# EAGLE design HW2_schematic (EAGLE 9.3.0)
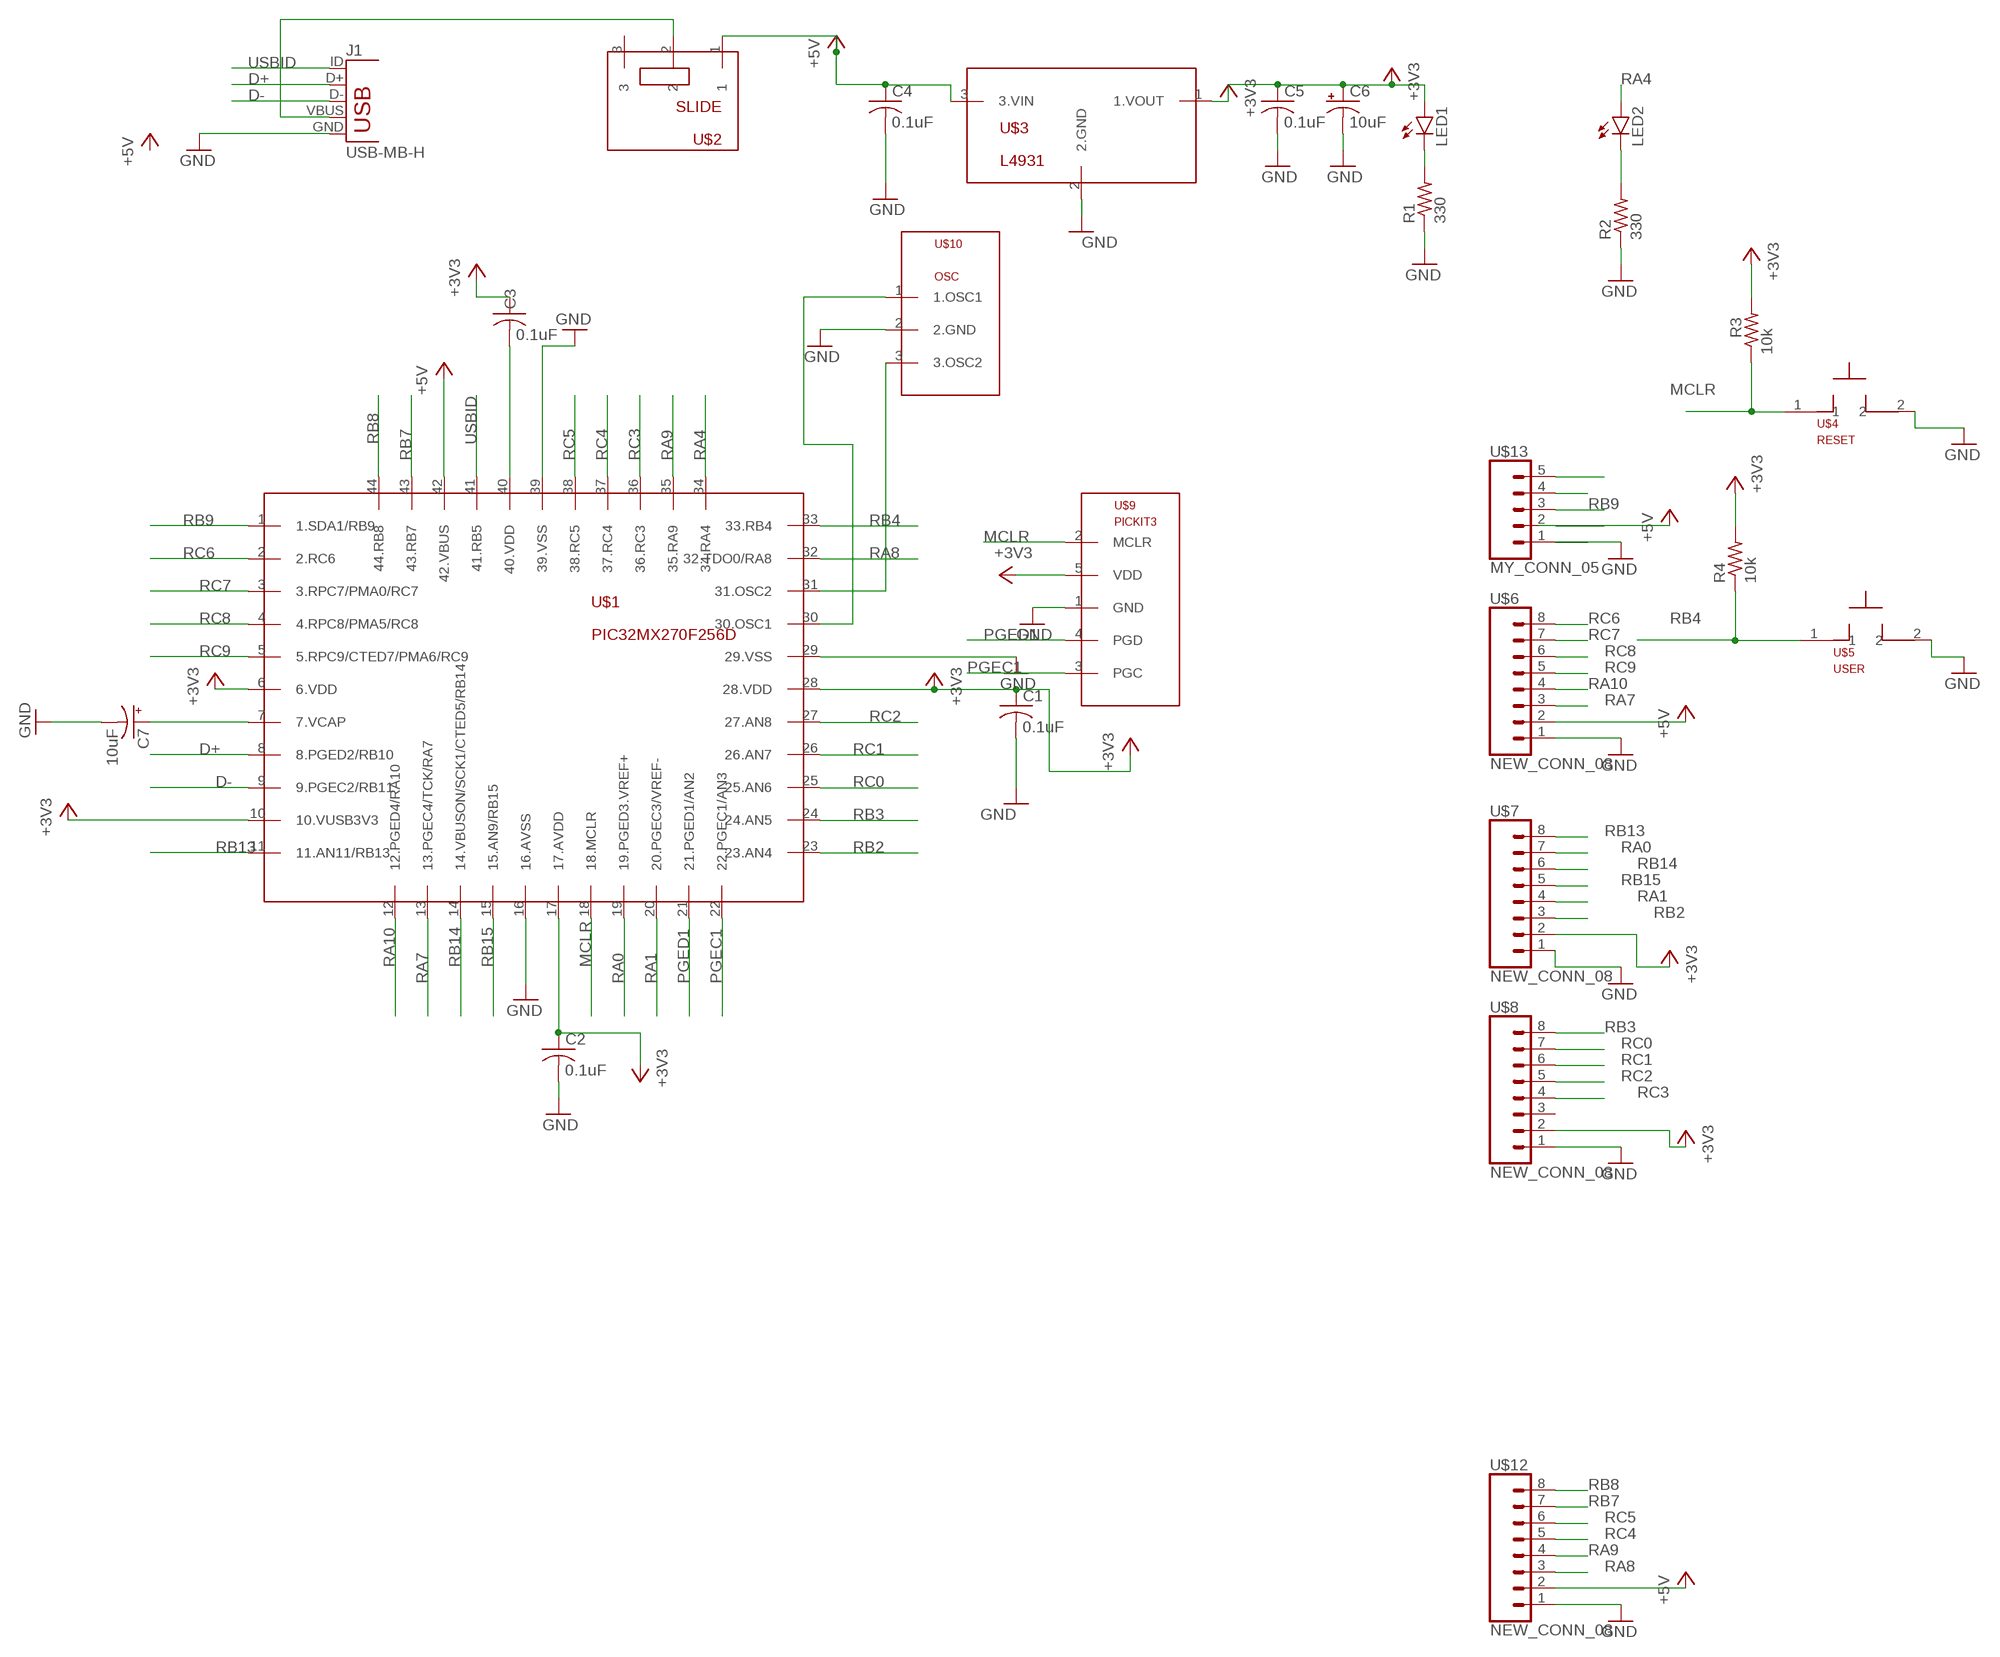
[diagram p0: schematic, sheet 1]

## Parts
C1  0.1uF  C-US025-025X050  [C025-025X050]
C2  0.1uF  C-US025-025X050  [C025-025X050]
C3  0.1uF  C-US025-025X050  [C025-025X050]
C4  0.1uF  C-US025-025X050  [C025-025X050]
C5  0.1uF  C-US025-025X050  [C025-025X050]
C6  10uF  CPOL-USB45181B  [B45181B]
C7  10uF  CPOL-USB45181B  [B45181B]
J1  USB-MB-H  [USB-MB-H]
LED1  LED3MM  [LED3MM]
LED2  LED3MM  [LED3MM]
R1  330  R-US_0207/10  [0207/10]
R2  330  R-US_0207/10  [0207/10]
R3  10k  R-US_0207/10  [0207/10]
R4  10k  R-US_0207/10  [0207/10]
U$1  PIC32MX270F256D  [QFN44ML8X8]
U$2  SLIDE  [SLIDE]
U$3  L4931  [TO92]
U$4  RESET  PB  [PB]
U$5  USER  PB  [PB]
U$6  NEW_CONN_08  [1X08]
U$7  NEW_CONN_08  [1X08]
U$8  NEW_CONN_08  [1X08]
U$9  PICKIT3  [1X05]
U$10  OSC  [OSC]
U$12  NEW_CONN_08  [1X08]
U$13  MY_CONN_05  [1X05]

## Nets
+3V3: C1.1 C2.1 C3.1 C5.1 C6.+ LED1.A R3.2 R4.2 U$1.6(6.VDD) U$1.10(10.VUSB3V3) U$1.17(17.AVDD) U$1.28(28.VDD) U$3.1(1.VOUT) U$7.2 U$8.2 U$9.5(VDD)
+5V: C4.1 U$1.42(42.VBUS) U$2.1 U$3.3(3.VIN) U$6.2 U$12.2
D+: J1.D+ U$1.8(8.PGED2/RB10)
D-: J1.D- U$1.9(9.PGEC2/RB11)
GND: C1.2 C2.2 C4.2 C5.2 C6.- C7.- J1.GND R1.1 R2.1 U$1.16(16.AVSS) U$1.29(29.VSS) U$1.39(39.VSS) U$3.2(2.GND) U$4.2 U$5.2 U$6.1 U$7.1 U$8.1 U$9.1(GND) U$10.2(2.GND) U$12.1
MCLR: R3.1 U$1.18(18.MCLR) U$4.1 U$9.2(MCLR)
N$1: J1.VBUS U$2.2
N$2: LED1.K(C) R1.2
N$3: LED2.K(C) R2.2
N$4: U$1.30(30.OSC1) U$10.1(1.OSC1)
N$5: U$1.31(31.OSC2) U$10.3(3.OSC2)
N$6: U$13.5
N$7: C3.2 U$1.40(40.VDD)
N$8: C7.+ U$1.7(7.VCAP)
N$9: U$13.4
N$11: U$13.2
N$12: U$13.1
PGEC1: U$1.22(22.PGEC1/AN3) U$9.3(PGC)
PGED1: U$1.21(21.PGED1/AN2) U$9.4(PGD)
RA0: U$1.19(19.PGED3.VREF+) U$7.7
RA1: U$1.20(20.PGEC3/VREF-) U$7.4
RA4: LED2.A U$1.34(34.RA4)
RA7: U$1.13(13.PGEC4/TCK/RA7) U$6.3
RA8: U$1.32(32.TDO0/RA8) U$12.3
RA9: U$1.35(35.RA9) U$12.4
RA10: U$1.12(12.PGED4/RA10) U$6.4
RB2: U$1.23(23.AN4) U$7.3
RB3: U$1.24(24.AN5) U$8.8
RB4: R4.1 U$1.33(33.RB4) U$5.1
RB7: U$1.43(43.RB7) U$12.7
RB8: U$1.44(44.RB8) U$12.8
RB9: U$1.1(1.SDA1/RB9) U$13.3
RB13: U$1.11(11.AN11/RB13) U$7.8
RB14: U$1.14(14.VBUSON/SCK1/CTED5/RB14) U$7.6
RB15: U$1.15(15.AN9/RB15) U$7.5
RC0: U$1.25(25.AN6) U$8.7
RC1: U$1.26(26.AN7) U$8.6
RC2: U$1.27(27.AN8) U$8.5
RC3: U$1.36(36.RC3) U$8.4
RC4: U$1.37(37.RC4) U$12.5
RC5: U$1.38(38.RC5) U$12.6
RC6: U$1.2(2.RC6) U$6.8
RC7: U$1.3(3.RPC7/PMA0/RC7) U$6.7
RC8: U$1.4(4.RPC8/PMA5/RC8) U$6.6
RC9: U$1.5(5.RPC9/CTED7/PMA6/RC9) U$6.5
USBID: J1.ID U$1.41(41.RB5)
Unconnected: U$2.3 U$8.3

## Library data of the parts
C1-C5 = HW2_library:C-US: CAPACITOR, American symbol; SPICEPREFIX: C
C6 C7 = HW2_library:CPOL-US: POLARIZED CAPACITOR, American symbol; SPICEPREFIX: C
J1 = HW2_library:USB: USB Connectors USB-B-PTH is fully proven SKU : PRT-00139/CONN-08278 USB-miniB is fully proven SKU : PRT-00587 USB-A-PCB is untested. USB-A-H is throughly reviewed, but untested. Spark Fun Electronics SKU : PRT-00437 USB-B-SMT is throughly reviewed, but untested. Needs silkscreen touching up. USB-A-S has not been used/tested USB-MB-H has not been used/tested USB-MICROB has been used. CONN-09505
LED1 LED2 = led:LED: LED OSRAM: - CHIPLED LG R971, LG N971, LY N971, LG Q971, LY Q971, LO R971, LY R971 LH N974, LH R974 LS Q976, LO Q976, LY Q976 LO Q996 - Hyper CHIPLED LW Q18S LB Q993, LB Q99A, LB R99A - SideLED LS A670, LO A670, LY A670, LG A670, LP A670 LB A673, LV A673, LT A673, LW A673 LH A674 LY A675 LS A676, LA A676, LO A676, LY A676, LW A676 LS A679, LY A679, LG A679 - Hyper Micro SIDELED® LS Y876, LA Y876, LO Y876, LY Y876 LT Y87S - SmartLED LW L88C, LW L88S LB L89C, LB L89S, LG L890 LS L89K, LO L89K, LY L89K LS L896, LA L896, LO L896, LY L896 - TOPLED LS T670, LO T670, LY T670, LG T670, LP T670 LSG T670, LSP T670, LSY T670, LOP T670, LYG T670 LG T671, LOG T671, LSG T671 LB T673, LV T673, LT T673, LW T673 LH T674 LS T676, LA T676, LO T676, LY T676, LB T676, LH T676, LSB T676, LW T676 LB T67C, LV T67C, LT T67C, LS T67K, LO T67K, LY T67K, LW E67C LS E67B, LA E67B, LO E67B, LY E67B, LB E67C, LV E67C, LT E67C LW T67C LS T679, LY T679, LG T679 LS T770, LO T770, LY T770, LG T770, LP T770 LB T773, LV T773, LT T773, LW T773 LH T774 LS E675, LA E675, LY E675, LS T675 LS T776, LA T776, LO T776, LY T776, LB T776 LHGB T686 LT T68C, LB T68C - Hyper Mini TOPLED® LB M676 - Mini TOPLED Santana® LG M470 LS M47K, LO M47K, LY M47K Source: http://www.osram.convergy.de LUXEON: - LUMILED® LXK2-PW12-R00, LXK2-PW12-S00, LXK2-PW14-U00, LXK2-PW14-V00 LXK2-PM12-R00, LXK2-PM12-S00, LXK2-PM14-U00 LXK2-PE12-Q00, LXK2-PE12-R00, LXK2-PE12-S00, LXK2-PE14-T00, LXK2-PE14-U00 LXK2-PB12-K00, LXK2-PB12-L00, LXK2-PB12-M00, LXK2-PB14-N00, LXK2-PB14-P00, LXK2-PB14-Q00 LXK2-PR12-L00, LXK2-PR12-M00, LXK2-PR14-Q00, LXK2-PR14-R00 LXK2-PD12-Q00, LXK2-PD12-R00, LXK2-PD12-S00 LXK2-PH12-R00, LXK2-PH12-S00 LXK2-PL12-P00, LXK2-PL12-Q00, LXK2-PL12-R00 Source: www.luxeon.com KINGBRIGHT: KA-3528ASYC Source: www.kingbright.com
R1-R4 = HW2_library:R-US_: RESISTOR, American symbol; SPICEPREFIX: R
U$1 = HW2_library:PIC32MX270F256D
U$2 = HW2_library:SLIDE
U$3 = HW2_library:L4931
U$4 U$5 = HW2_library:PB
U$6-U$8 U$12 = HW2_library:NEW_CONN_08
U$9 = HW2_library:PICKIT3
U$10 = HW2_library:OSC
U$13 = HW2_library:MY_CONN_05

## Board
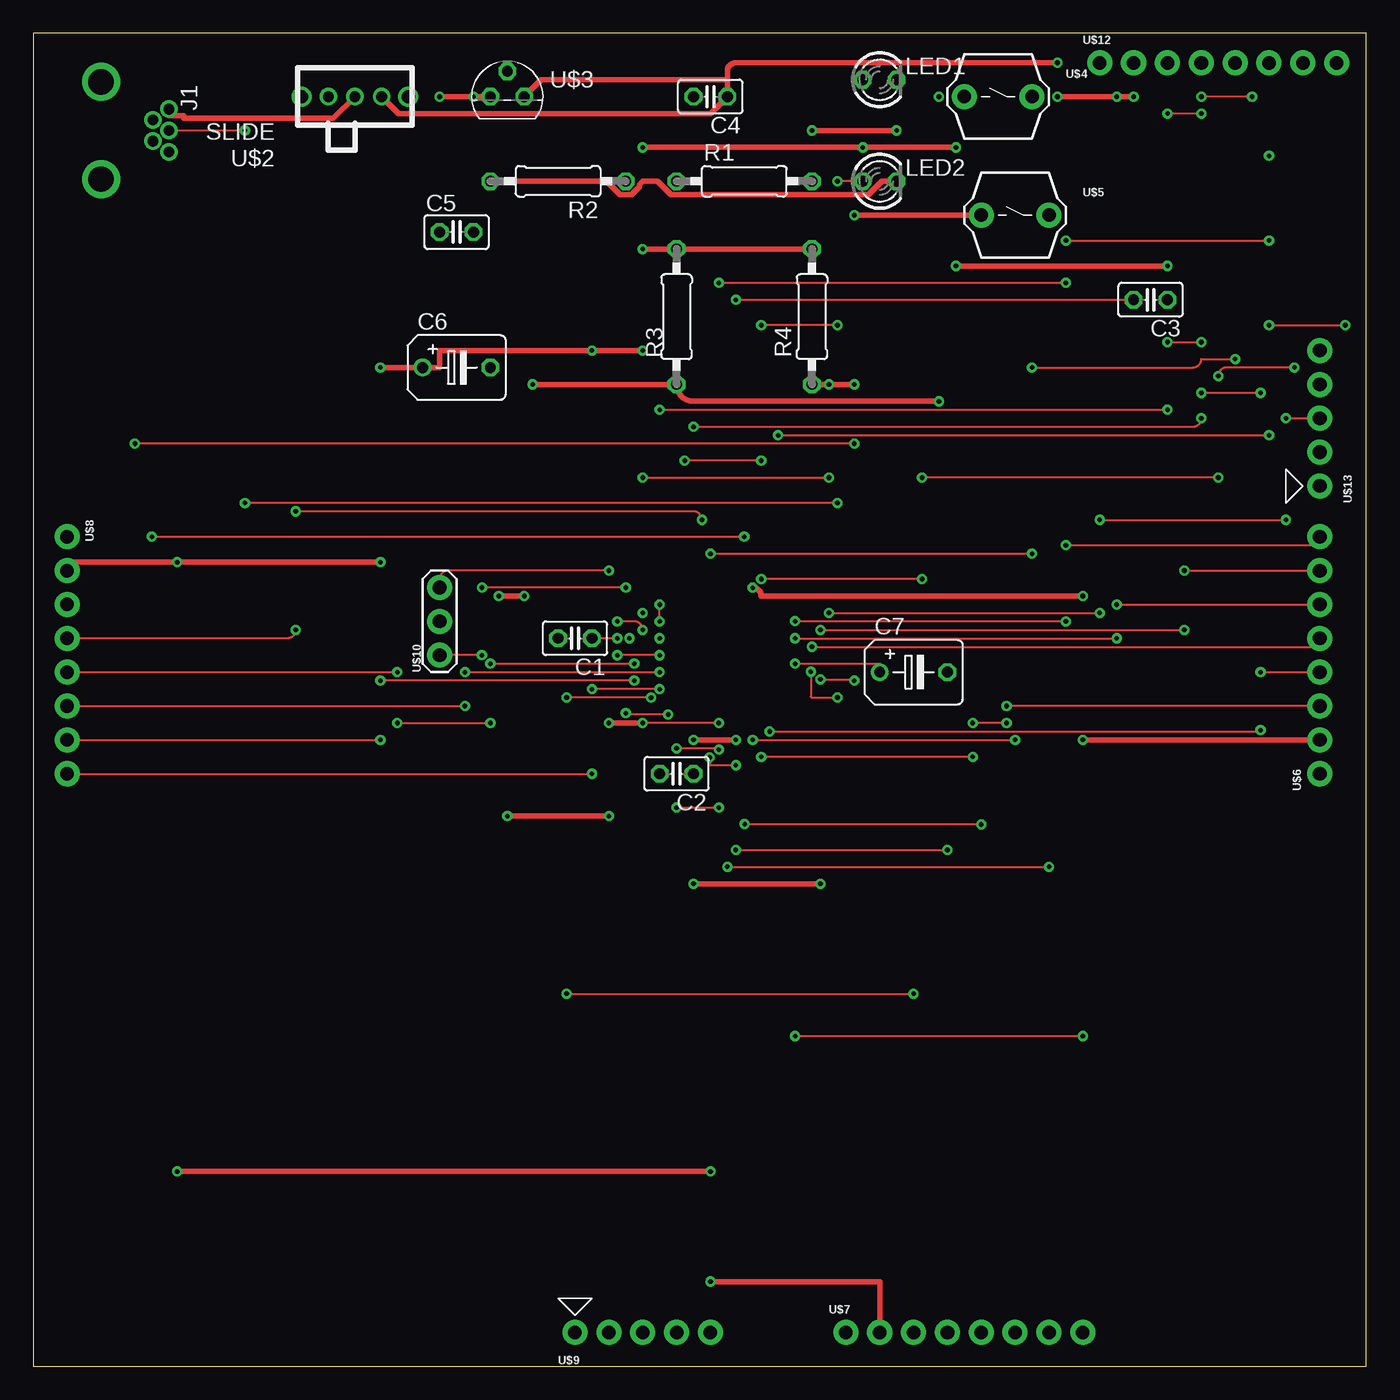
[diagram p1: board, top side]
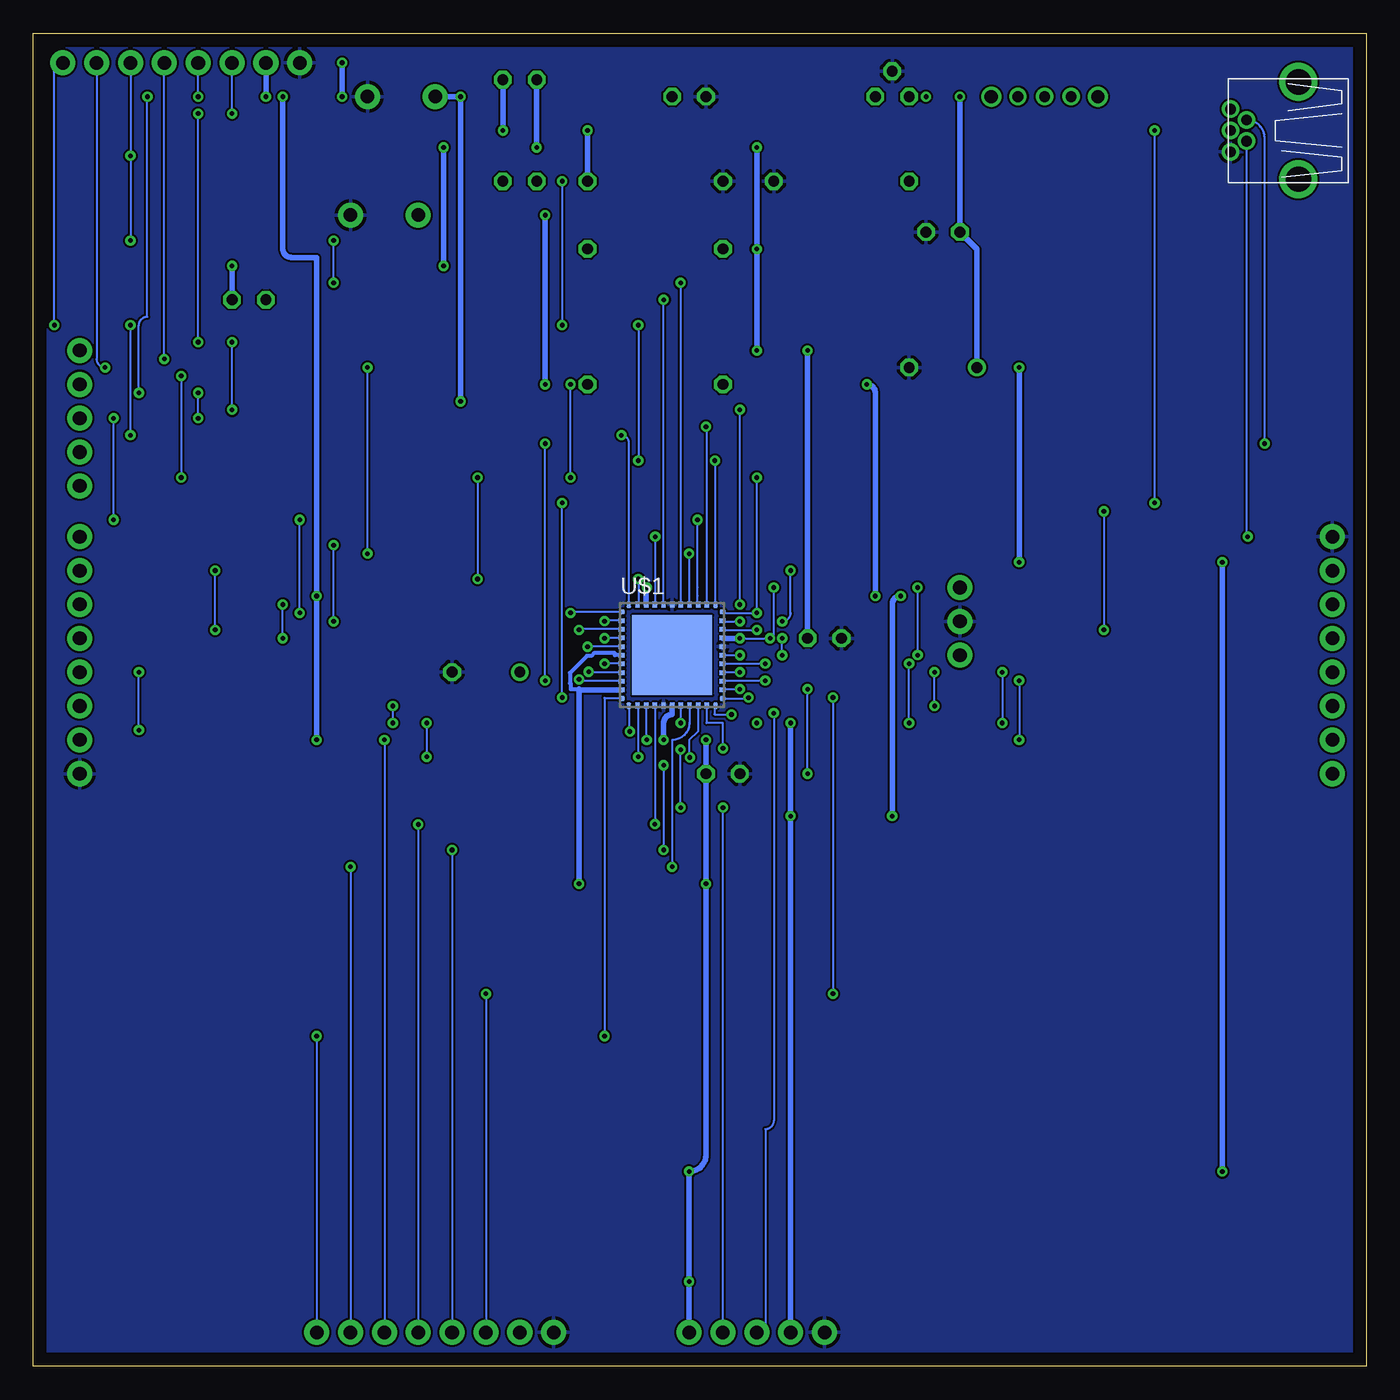
[diagram p2: board, bottom side, seen from below]

Size 100 x 100 mm. Coordinates in mm from the lower left corner, seen from the top.
Outline: 0,0 100,0 100,100 0,100 0,0
Copper layers (1*16): Top 0.035mm / dielectric 1.5mm / Bottom 0.035mm
Design rules "default": minimum track width 6mil, minimum drill 0.35mm, track to track 6mil, track to pad 6mil, pad to pad 6mil, via to via 6mil, smd to smd 6mil, copper to edge 40mil, drill to drill 6mil, minimum pad ring 10mil, minimum via ring 8mil, stop-mask expansion 4mil, vias tented up to drill 0mil, thermal gap 10mil

### Footprints (pad centres in the part's own frame; a part is rotated, then mirrored left to right if it is on the bottom)
C025-025X050 = drill 0.813 octagon: 1 -1.27,0; 2 1.27,0
B45181B = drill 0.813: + -2.54,0 | drill 0.813 octagon: - 2.54,0
USB-MB-H = drill 0.8: D+ 5.1,0; D- 3.9,0.8; GND 5.1,-1.6; ID 3.9,-0.8; VBUS 5.1,1.6 | drill 1.9: P$6 0,-3.65; P$7 0,3.65
LED3MM = drill 0.813 octagon: A -1.27,0; K 1.27,0
0207/10 = drill 0.813 octagon: 1 -5.08,0; 2 5.08,0
QFN44ML8X8 = smd 0.45 x 0.33: 1 -3.788,3.25; 2 -3.788,2.6; 3 -3.788,1.95; 4 -3.788,1.3; 5 -3.788,0.65; 6 -3.788,0; 7 -3.788,-0.65; 8 -3.788,-1.3; 9 -3.788,-1.95; 10 -3.788,-2.6; 11 -3.788,-3.25; 23 3.788,-3.25; 24 3.788,-2.6; 25 3.788,-1.95; 26 3.788,-1.3; 27 3.788,-0.65; 28 3.788,0; 29 3.788,0.65; 30 3.788,1.3; 31 3.788,1.95; 32 3.788,2.6; 33 3.788,3.25 | smd 0.33 x 0.45: 12 -3.25,-3.788; 13 -2.6,-3.788; 14 -1.95,-3.788; 15 -1.3,-3.788; 16 -0.65,-3.788; 17 0,-3.788; 18 0.65,-3.788; 19 1.3,-3.788; 20 1.95,-3.788; 21 2.6,-3.788; 22 3.25,-3.788; 34 3.25,3.788; 35 2.6,3.788; 36 1.95,3.788; 37 1.3,3.788; 38 0.65,3.788; 39 0,3.788; 40 -0.65,3.788; 41 -1.3,3.788; 42 -1.95,3.788; 43 -2.6,3.788; 44 -3.25,3.788 | smd 6 x 6: EXP 0,0
SLIDE = drill 0.8: 1 -2,0; 2 0,0; 3 2,0 | drill 1: P$1 -4,0; P$2 4,0
TO92 = drill 0.813 octagon: 1 -1.27,0; 2 0,1.905; 3 1.27,0
PB = drill 1.016 pad 1.88: 1 -2.54,0; 2 2.54,0
1X08 = drill 1.016 pad 1.88: 1 0,0; 2 2.54,0; 3 5.08,0; 4 7.62,0; 5 10.16,0; 6 12.7,0; 7 15.24,0; 8 17.78,0
1X05 = drill 1.016 pad 1.88: 1 0,0; 2 2.54,0; 3 5.08,0; 4 7.62,0; 5 10.16,0
OSC = drill 1.016 pad 1.88: 1 -2.54,0; 2 0,0; 3 2.54,0

### Placement (x,y rotation side)
C1  40.64,54.61 180 top
C2  48.26,44.45 180 top
C3  83.82,80.01 180 top
C4  50.8,95.25 180 top
C5  31.75,85.09 0 top
C6  31.75,74.93 0 top
C7  66.04,52.07 0 top
J1  5.08,92.71 0 top
LED1  63.5,96.52 0 top
LED2  63.5,88.9 0 top
R1  53.34,88.9 0 top
R2  39.37,88.9 180 top
R3  48.26,78.74 90 top
R4  58.42,78.74 90 top
U$1  52.07,53.34 0 bottom
U$2  24.13,95.25 180 top
U$3  35.56,95.25 0 top
U$4  72.39,95.25 0 top
U$5  73.66,86.36 0 top
U$6  96.52,44.45 90 top
U$7  60.96,2.54 0 top
U$8  2.54,62.23 270 top
U$9  40.64,2.54 0 top
U$10  30.48,55.88 90 top
U$12  80.01,97.79 0 top
U$13  96.52,66.04 90 top

### Tracks (layer width: path | path; a pad name or v marks a point on that pad's centre or on a via)
+3V3  (via drill 0.35)
  Top 0.152: v46.99,53.34 v43.81,53.34 | v43.81,54.61 C1.1
  Top 0.406: v30.48,95.25 v33.02,95.25 U$3.1 | v45.72,76.2 v41.91,76.2 30.48,76.2 30.48,74.93 C6.+ v26.04,74.93 | v45.72,83.82 R3.2 R4.2 | U$8.2 arc-90 3.17,60.33 v10.79,60.33 v26.04,60.33 | v45.72,91.44 v62.23,91.44 v69.22,91.44 | v69.22,82.55 v85.09,82.55 | v10.79,14.61 v50.8,14.61 | v52.7,46.99 v49.53,46.99 | v59.05,36.2 v49.53,36.2 | v50.8,6.35 63.5,6.35 U$7.2
  Bottom 0.152: U$1.28 v46.99,53.34 | v43.81,53.34 v43.81,54.61
  Bottom 0.305: U$1.6 56.37,53.34 56.37,53.49 57.94,53.49 58.14,53.29 58.47,53.29 59.74,52.02 59.74,51.25 59.69,51.2 59.69,50.8 59.05,50.8 58.99,50.74
  Bottom 0.406: v30.48,95.25 C5.1 29.21,83.82 C6.+ | LED1.A v62.23,91.44 | v45.72,91.44 v45.72,83.82 v45.72,76.2 | v26.04,60.33 v26.04,74.93 | v85.09,82.55 C3.1 | v69.22,91.44 v69.22,82.55 | v10.79,60.33 v10.79,14.61 | U$9.5 v50.8,6.35 v50.8,14.61 arc-90 49.53,15.88 v49.53,36.2 C2.1 v49.53,46.99 | U$1.17 52.07,48.9 arc-90 52.7,48.26 v52.7,46.99 | C1.1 v41.91,76.2 | U$1.10 58.99,50.74 arc90 59.05,50.8 v59.05,36.2
+5V  (via drill 0.35)
  Top 0.406: U$2.1 27.4,93.98 50.8,93.98 C4.1 52.07,96.52 | U$3.3 38.1,96.52 52.07,96.52 | v82.55,95.25 v81.28,95.25 v76.83,95.25 | v76.83,97.79 52.7,97.79 arc90 52.07,97.16 52.07,96.52 | v78.74,46.99 U$6.2 | v53.97,58.41 53.98,58.41 arc-90 54.61,57.78 v78.74,57.78
  Bottom 0.406: U$12.2 v82.55,95.25 | v76.83,95.25 v76.83,97.79 | v81.28,95.25 81.28,86.36 81.28,83.82 arc-90 80.64,83.19 78.74,83.19 v78.74,57.78 v78.74,46.99 | U$1.42 54.02,58.36 arc90 v53.97,58.41
D+  (via drill 0.35)
  Top 0.152: v58.33,52.1 58.33,50.25 arc90 58.42,50.16 v60.33,50.16 | v60.33,64.77 v15.88,64.77 | v15.88,92.71 J1.D+
  Bottom 0.152: U$1.8 58.28,52.04 arc90 v58.33,52.1 | v60.33,50.16 v60.33,64.77 | v15.88,64.77 v15.88,92.71
D-  (via drill 0.35)
  Top 0.152: v61.59,69.22 v7.62,69.22 | v59.05,51.53 61.5,51.53 arc-90 v61.59,51.44
  Bottom 0.152: v61.59,51.44 v61.59,69.22 | v7.62,69.22 7.62,92.15 arc-90 J1.D- | U$1.9 58.91,51.39 arc90 v59.05,51.53
GND
  pour Bottom: 0,0 0,99.69 100.33,99.69 100.33,-0.64 arc-90 99.69,-1.27 0,-1.27
MCLR  (via drill 0.35)
  Top 0.152: v51.44,48.26 v45.72,48.26
  Top 0.406: v45.72,48.26 v43.18,48.26 | v37.47,73.66 R3.1 arc90 49.53,72.39 v67.94,72.39 | v36.83,57.78 v34.92,57.78 | v35.56,41.27 v43.18,41.27
  Bottom 0.152: U$1.18 arc-90 51.44,49.54 v51.44,48.26
  Bottom 0.406: U$4.1 v67.94,95.25 v67.94,72.39 | v37.47,73.66 arc90 36.83,73.03 v36.83,57.78 | v34.92,57.78 arc-90 35.56,57.15 v35.56,41.27 | U$9.2 v43.18,41.27 v43.18,48.26
N$1
  Top 0.406: U$2.2 22.51,93.63 11.29,93.63 11.29,93.82 10.18,93.82 J1.VBUS
N$2  (via drill 0.35)
  Top 0.406: v58.42,92.71 v64.77,92.71
  Bottom 0.406: R1.2 v58.42,92.71 | v64.77,92.71 LED1.K
N$3
  Top 0.406: LED2.K 63.67,88.9 62.65,87.88 47.84,87.88 46.82,88.9 45.72,88.9 45.47,88.65 45.47,88.48 44.87,87.88 44.03,87.88 43.01,88.9 R2.2
N$4  (via drill 0.35)
  Top 0.152: v44.45,58.42 v33.66,58.42 | v33.65,53.35 arc-90 v33.64,53.34 U$10.1
  Bottom 0.152: U$1.30 arc-90 48.25,54.61 | 47.62,54.61 v44.72,54.61 arc-90 44.45,54.88 v44.45,58.42 | v33.66,58.42 v33.66,53.34 arc-90 v33.65,53.35
  Bottom 0.406: U$1.30 arc-90 48.25,54.61 47.62,54.61 v46.99,54.61
N$5  (via drill 0.35)
  Top 0.152: v45.72,55.24 arc90 45.09,55.88 v43.81,55.88 | v43.18,59.69 31.11,59.69 arc90 30.48,59.05 U$10.3
  Bottom 0.152: 48.24,55.24 arc90 U$1.31 arc-90 48.24,55.24 | 48.24,55.24 v45.72,55.24 | v43.81,55.88 arc-90 43.18,56.52 v43.18,59.69
N$7  (via drill 0.35)
  Top 0.152: v52.7,80.01 C3.2
  Bottom 0.152: U$1.40 52.72,80 arc90 v52.7,80.01
N$8  (via drill 0.35)
  Top 0.152: v57.15,52.7 63.5,52.7 C7.+
  Bottom 0.152: U$1.7 arc-90 55.87,52.7 v57.15,52.7
PGEC1  (via drill 0.35)
  Top 0.152: v47.62,48.9 44.45,48.9 v44.45,48.99
  Bottom 0.152: U$1.22 arc-90 48.9,49.48 48.9,48.9 v47.62,48.9 | U$9.3 arc-90 45.09,3.17 45.09,17.78 arc-90 44.45,18.41 v44.45,48.99
PGED1  (via drill 0.35)
  Top 0.152: v48.26,41.91 v51.44,41.91 | v51.44,46.26 arc90 51.34,46.35 v48.26,46.35
  Bottom 0.152: U$9.4 v48.26,41.91 | v51.44,41.91 v51.44,46.26 | v48.26,46.35 48.26,48.26 49.53,48.26 arc-90 49.47,48.32 U$1.21
RA0  (via drill 0.35)
  Top 0.152: v52.07,37.47 v76.2,37.47
  Bottom 0.152: U$1.19 50.77,48.29 arc90 52.07,46.99 v52.07,37.47 | v76.2,37.47 U$7.7
RA1  (via drill 0.35)
  Top 0.152: v52.7,38.73 v68.58,38.73 | v52.7,45.09 50.8,45.09 50.8,45.61 v50.74,45.66
  Bottom 0.152: U$1.20 50.12,47.62 50.8,46.99 50.8,46.97 50.8,45.72 v50.74,45.66 | v52.7,45.09 v52.7,38.73 | v68.58,38.73 U$7.4
RA4  (via drill 0.35)
  Top 0.152: LED2.A v60.33,88.9 | v60.33,78.11 v54.61,78.11 | v54.61,67.94 v48.86,67.94
  Bottom 0.152: v60.33,88.9 v60.33,78.11 | v54.61,78.11 v54.61,67.94 | v48.86,67.94 48.86,57.17 arc-90 U$1.34
RA7  (via drill 0.35)
  Top 0.152: U$6.3 v73.03,49.53 | v73.03,48.26 v70.48,48.26 | v70.48,45.72 v54.61,45.72
  Bottom 0.152: v73.03,49.53 v73.03,48.26 | v70.48,48.26 v70.48,45.72 | v54.61,45.72 54.61,49.49 arc-90 U$1.13
RA8  (via drill 0.35)
  Top 0.152: v46.99,55.88 v46.99,57.15 | v46.99,71.75 v85.09,71.75 | v85.09,76.83 v87.63,76.83 | v87.63,93.98 v85.09,93.98
  Bottom 0.152: 48.22,55.88 arc90 U$1.32 arc-90 48.22,55.88 | 48.22,55.88 v46.99,55.88 | v46.99,57.15 v46.99,71.75 | v85.09,71.75 v85.09,76.83 | v87.63,76.83 v87.63,93.98 | v85.09,93.98 U$12.3
RA9  (via drill 0.35)
  Top 0.152: v49.53,70.48 87,70.48 arc90 v87.63,71.12 | v91.44,95.25 v87.63,95.25 | v87.63,73.03 v92.08,73.03
  Bottom 0.152: U$1.35 49.47,70.42 arc-90 v49.53,70.48 | v87.63,71.12 v87.63,73.03 | v92.08,73.03 92.08,78.11 arc90 91.44,78.74 v91.44,95.25 | v87.63,95.25 U$12.4
RA10  (via drill 0.35)
  Top 0.152: v55.24,47.62 91.98,47.62 arc90 v92.08,47.72 | v92.08,52.07 U$6.4
  Bottom 0.152: U$1.12 55.32,47.7 arc-90 v55.24,47.62 | v92.08,47.72 v92.08,52.07
RB2  (via drill 0.35)
  Top 0.152: v46.35,50.16 v40.01,50.16 arc-90 v40.01,50.16 | v40.01,27.94 v66.04,27.94
  Bottom 0.152: U$1.23 46.41,50.09 arc-90 v46.35,50.16 | v40.01,50.16 v40.01,27.94 | v66.04,27.94 U$7.3
RB3  (via drill 0.35)
  Top 0.152: U$8.8 v41.91,44.45 | v46.99,50.8 v41.91,50.8
  Bottom 0.152: v41.91,44.45 v41.91,50.8 | U$1.24 arc90 48.22,50.8 v46.99,50.8
RB4  (via drill 0.35)
  Top 0.152: v45.72,66.67 v59.69,66.67
  Top 0.406: U$5.1 v61.59,86.36 | v61.59,73.66 v59.69,73.66 R4.1
  Bottom 0.152: 48.21,56.52 arc90 U$1.33 arc-90 48.21,56.52 | 48.21,56.52 v45.72,56.52 v45.72,66.67 | v59.69,66.67 v59.69,73.66
  Bottom 0.406: v61.59,86.36 v61.59,73.66
RB7  (via drill 0.35)
  Top 0.152: v94.61,74.93 89.53,74.93 arc90 v88.9,74.3 | v88.9,66.67 v66.67,66.67 | v66.67,59.05 v54.61,59.05
  Bottom 0.152: U$12.7 95.25,75.56 arc-90 v94.61,74.93 | v88.9,74.3 v88.9,66.67 | v66.67,66.67 v66.67,59.05 | v54.61,59.05 54.61,57.19 arc90 U$1.43
RB8  (via drill 0.35)
  Top 0.152: v55.88,69.85 v92.71,69.85 | v92.71,78.11 v98.42,78.11
  Bottom 0.152: U$1.44 55.32,69.29 arc-90 v55.88,69.85 | v92.71,69.85 v92.71,78.11 | v98.42,78.11 98.42,97.16 arc90 U$12.8
RB9  (via drill 0.35)
  Top 0.152: v59.69,56.52 v80.01,56.52 | v80.01,63.5 v93.98,63.5 | v93.98,71.12 U$13.3
  Bottom 0.152: U$1.1 59.62,56.59 | 59.62,56.59 arc-90 v59.69,56.52 arc90 59.62,56.59 | v80.01,56.52 v80.01,63.5 | v93.98,63.5 v93.98,71.12
RB13  (via drill 0.35)
  Top 0.152: v57.15,24.77 v78.74,24.77
  Bottom 0.152: U$1.11 57.08,50.09 arc90 57.15,50.16 v57.15,24.77 | v78.74,24.77 U$7.8
RB14  (via drill 0.35)
  Top 0.152: v53.98,46.99 v73.66,46.99
  Bottom 0.152: U$1.14 54.02,47.03 arc-90 v53.98,46.99 | v73.66,46.99 U$7.6
RB15  (via drill 0.35)
  Top 0.152: v53.37,40.67 71.09,40.67 arc-90 v71.12,40.64
  Bottom 0.152: U$1.15 v53.37,40.67 | v71.12,40.64 U$7.5
RC0  (via drill 0.35)
  Top 0.152: v45.09,51.44 v26.04,51.44 | U$8.7 v26.04,46.99
  Bottom 0.152: U$1.25 arc90 48.24,51.44 v45.09,51.44 | v26.04,51.44 v26.04,46.99
RC1  (via drill 0.35)
  Top 0.152: U$8.6 v32.38,49.53 | v32.38,52.07 v46.99,52.07
  Bottom 0.152: U$1.26 arc90 48.25,52.07 v46.99,52.07 | v32.38,49.53 v32.38,52.07
RC2  (via drill 0.35)
  Top 0.152: U$8.5 v27.3,52.07 | v27.3,48.26 v34.29,48.26 | v34.29,52.7 v45.09,52.7
  Bottom 0.152: U$1.27 arc90 48.27,52.7 v45.09,52.7 | v27.3,52.07 v27.3,48.26 | v34.29,48.26 v34.29,52.7
RC3  (via drill 0.35)
  Top 0.152: v50.16,63.5 arc90 49.53,64.14 v19.68,64.14 | v19.68,55.24 arc-90 19.05,54.61 U$8.4
  Bottom 0.152: U$1.36 arc90 50.16,57.17 50.16,57.78 50.16,58.42 v50.16,63.5 | v19.68,64.14 v19.68,55.24
RC4  (via drill 0.35)
  Top 0.152: v50.8,60.96 v74.93,60.96 | v74.93,74.93 87,74.93 arc90 87.63,75.56 v90.17,75.56
  Bottom 0.152: U$1.37 50.77,60.93 arc-90 v50.8,60.96 | v74.93,60.96 v74.93,74.93 | v90.17,75.56 U$12.5
RC5  (via drill 0.35)
  Top 0.152: v51.44,81.28 v77.47,81.28 | v77.47,84.45 v92.71,84.45
  Bottom 0.152: U$1.38 51.42,81.27 arc-90 v51.44,81.28 | v77.47,81.28 v77.47,84.45 | U$12.6 v92.71,84.45 v92.71,90.81
RC6  (via drill 0.35)
  Top 0.152: v57.15,55.9 77.45,55.9 arc-90 v77.47,55.88 | v77.47,61.59 95.89,61.59 arc90 U$6.8
  Bottom 0.152: U$1.2 57.11,55.94 arc-90 v57.15,55.9 | v77.47,55.88 v77.47,61.59
RC7  (via drill 0.35)
  Top 0.152: v59.05,55.24 v86.36,55.24 | v86.36,59.69 U$6.7
  Bottom 0.152: U$1.3 59.01,55.29 arc-90 v59.05,55.24 | v86.36,55.24 v86.36,59.69
RC8  (via drill 0.35)
  Top 0.152: v57.15,54.61 v81.28,54.61 | v81.28,57.15 U$6.6
  Bottom 0.152: U$1.4 57.12,54.64 arc-90 v57.15,54.61 | v81.28,54.61 v81.28,57.15
RC9  (via drill 0.35)
  Top 0.152: v58.42,53.98 95.89,53.98 arc90 U$6.5
  Bottom 0.152: U$1.5 58.41,53.99 arc-90 v58.42,53.98
USBID  (via drill 0.35)
  Top 0.152: v8.89,62.23 v53.34,62.23
  Bottom 0.152: J1.ID 8.98,62.32 arc-90 v8.89,62.23 | v53.34,62.23 53.34,57.16 arc90 U$1.41